# EAGLE design mm_robot_pcb_v6 (EAGLE 9.6.2)
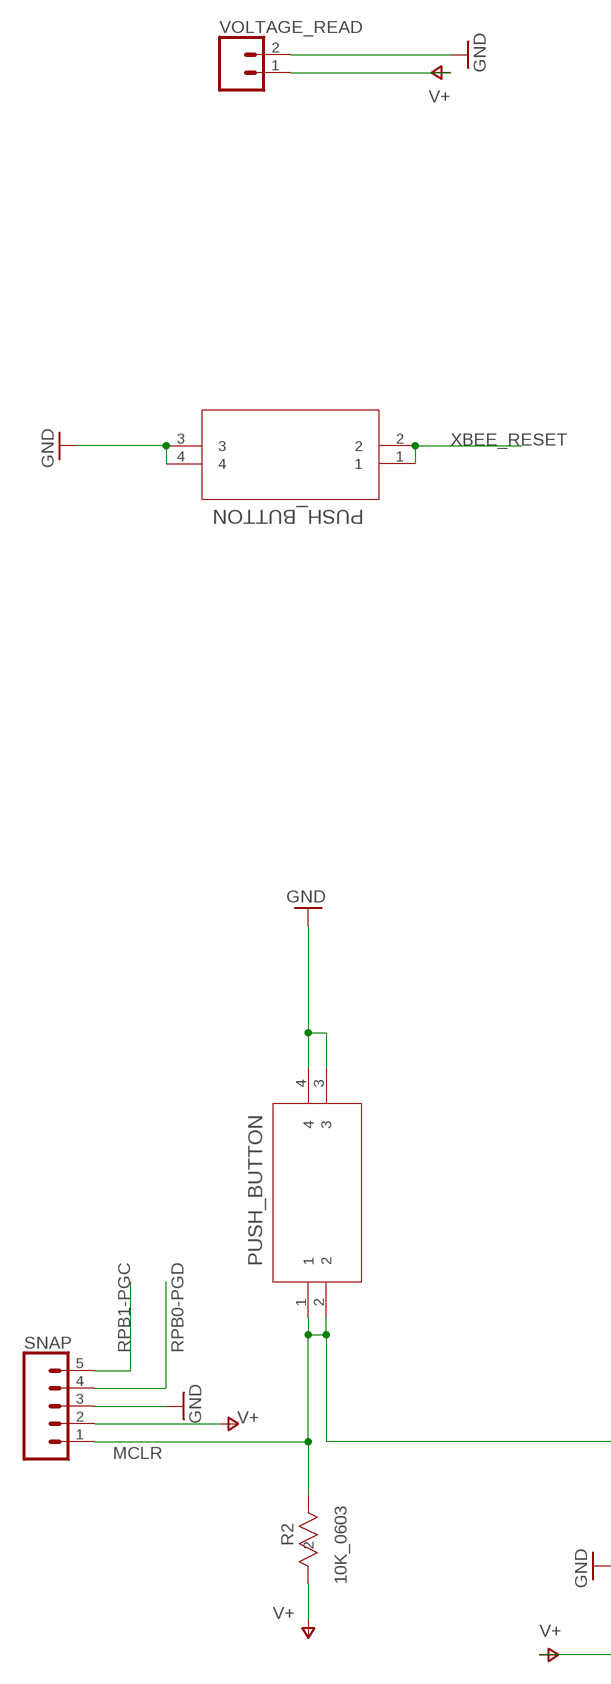
[diagram p0: schematic, sheet 1, part 1 of 2]
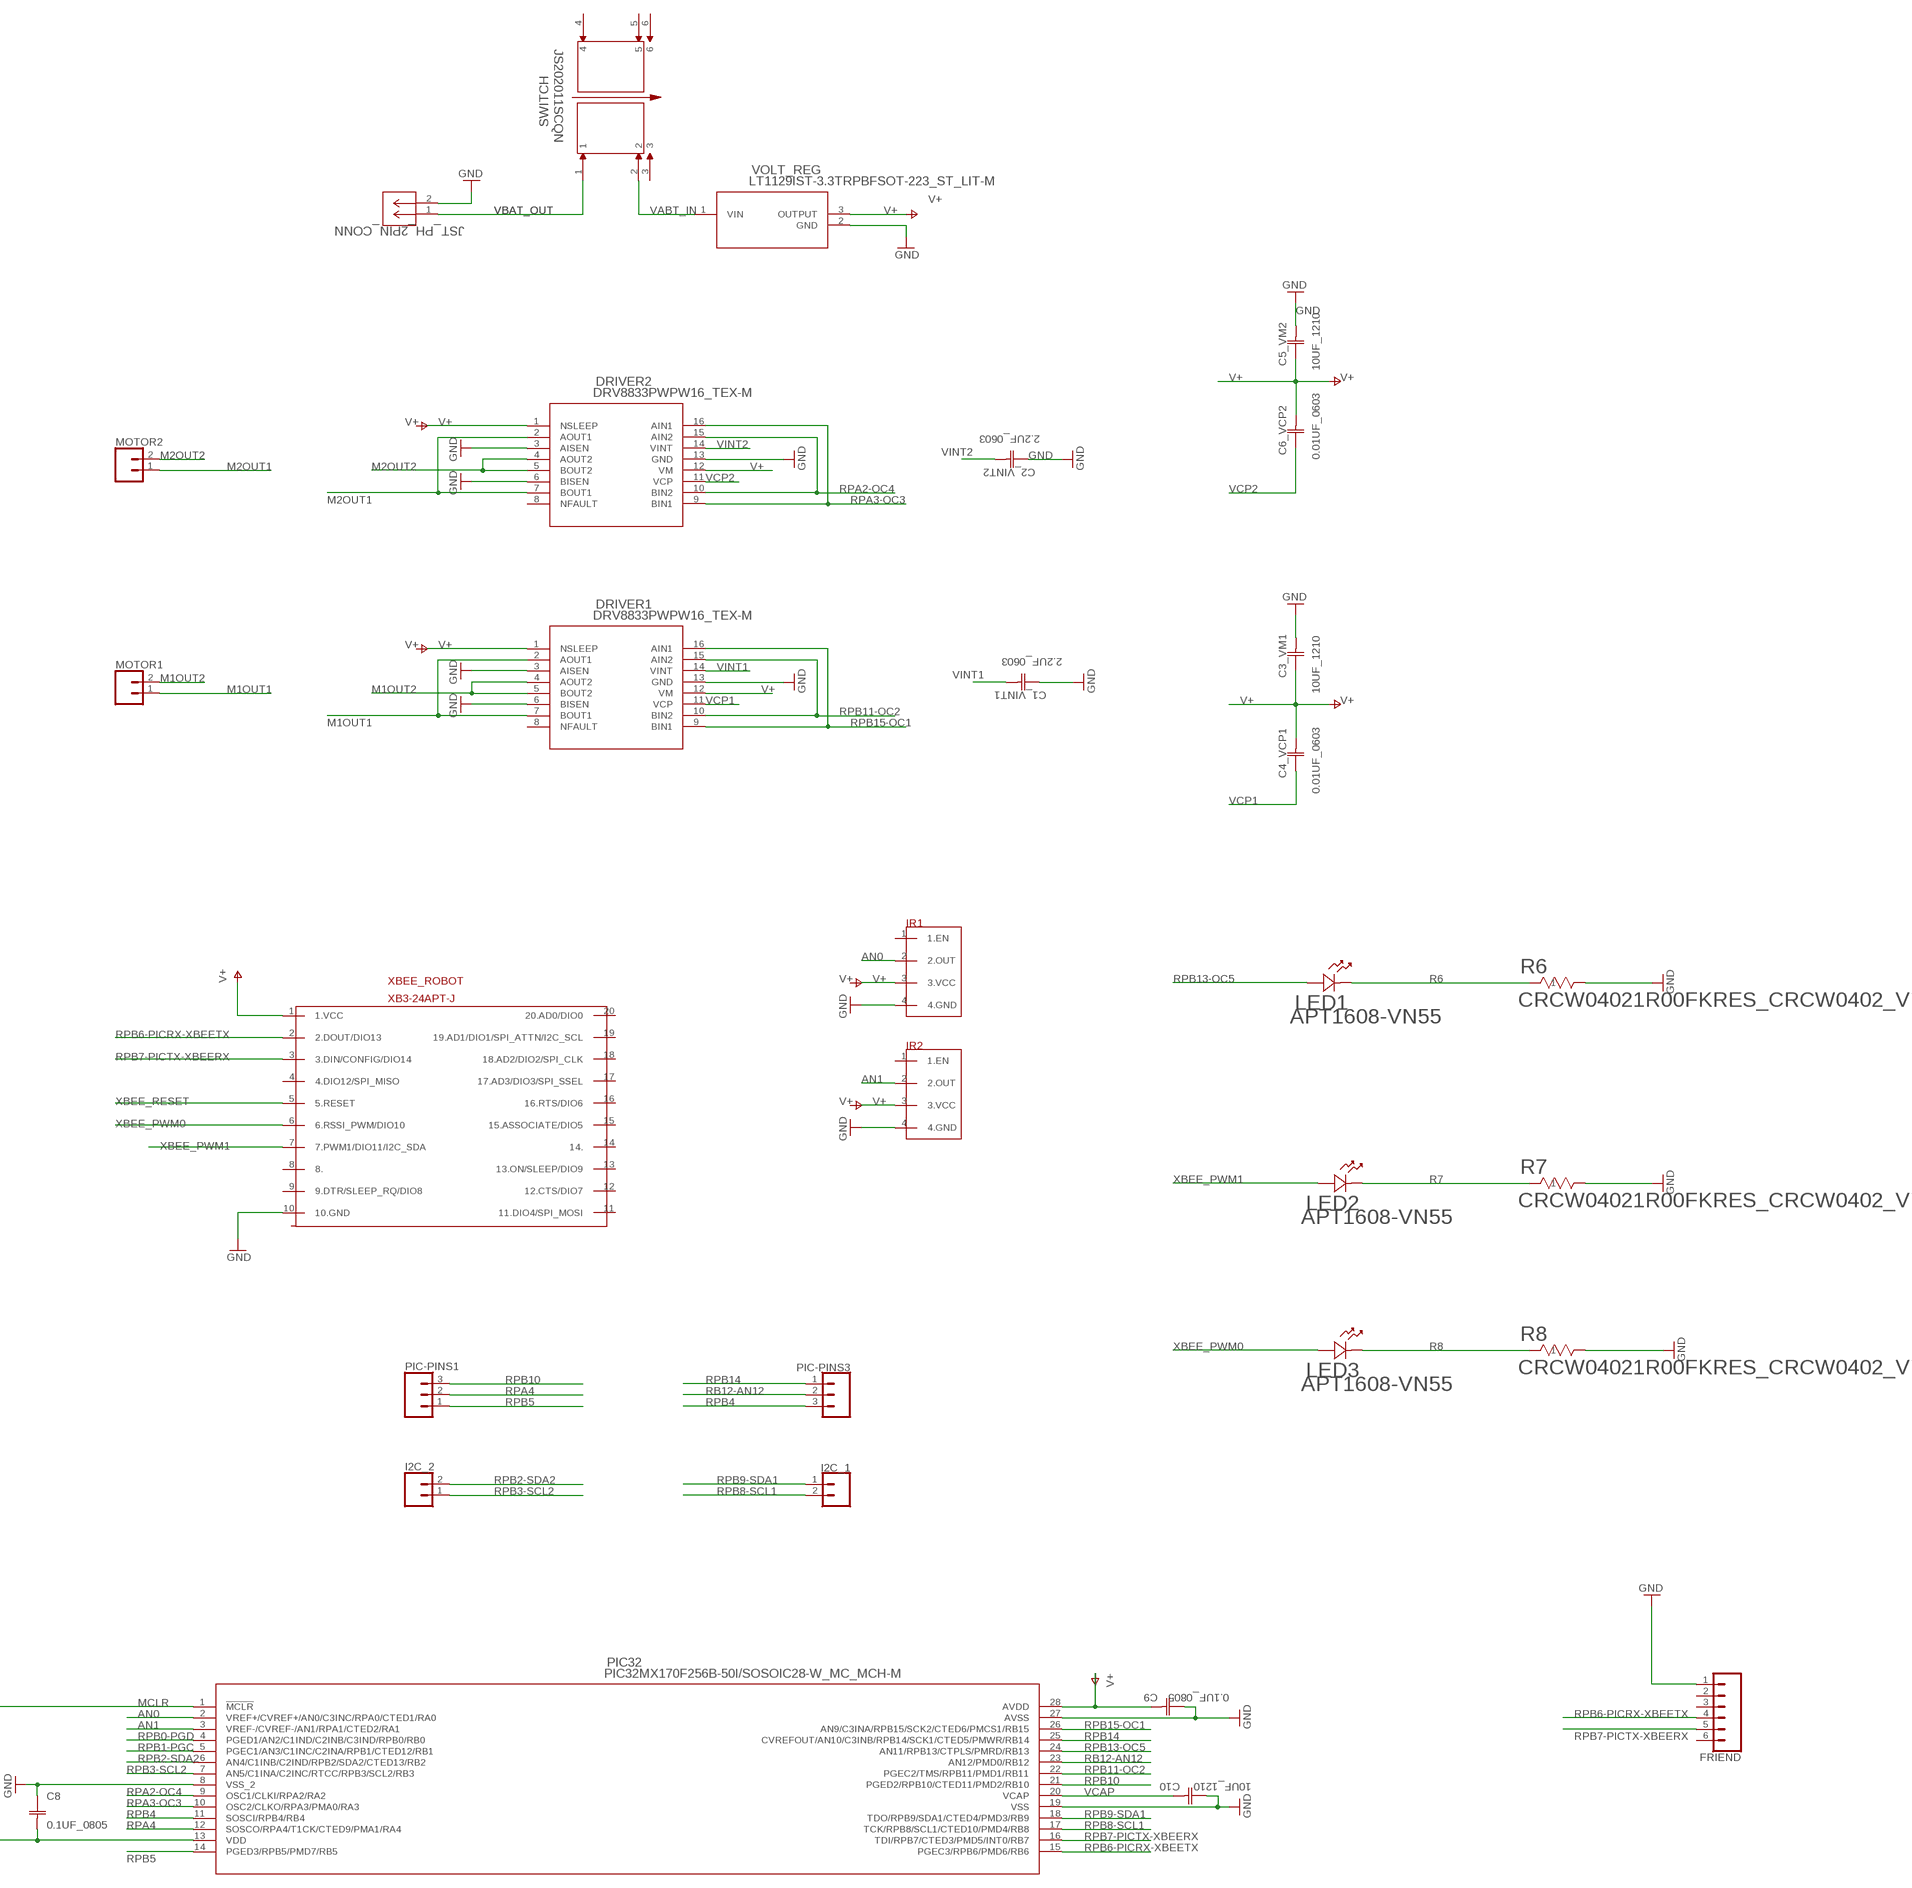
[diagram p1: schematic, sheet 1, part 2 of 2]

## Parts
C1_VINT1  2.2UF_0603  CL10A225KP8NNNCCAP_CL10_SAM-M  [CAP_CL10_SAM-M]
C2_VINT2  2.2UF_0603  CL10A225KP8NNNCCAP_CL10_SAM-M  [CAP_CL10_SAM-M]
C3_VM1  10UF_1210  TPSB106K016R0500CAP_TPS_B_AVX-M  [CAP_TPS_B_AVX-M]
C4_VCP1  0.01UF_0603  01UF_CAP  [CAP_01UF_0603_X7R_G_AVX]
C5_VM2  10UF_1210  TPSB106K016R0500CAP_TPS_B_AVX-M  [CAP_TPS_B_AVX-M]
C6_VCP2  0.01UF_0603  01UF_CAP  [CAP_01UF_0603_X7R_G_AVX]
C8  0.1UF_0805  C2012X7R2A104K125AACAP_C2012X7R2A104K125AA_TDK-M  [CAP_C2012X7R2A104K125AA_TDK-M]
C9  0.1UF_0805  C2012X7R2A104K125AACAP_C2012X7R2A104K125AA_TDK-M  [CAP_C2012X7R2A104K125AA_TDK-M]
C10  10UF_1210  TPSB106K016R0500CAP_TPS_B_AVX-M  [CAP_TPS_B_AVX-M]
DRIVER1  DRV8833PWPW16_TEX-M  [PW16_TEX-M]
DRIVER2  DRV8833PWPW16_TEX-M  [PW16_TEX-M]
FRIEND  CONN_06NO_SILK_FEMALE_PTH  [1X06_NO_SILK]
I2C_1  CONN_02  [1X02]
I2C_2  CONN_02  [1X02]
IR1  GP2Y0A60SZLF  [1X04]
IR2  GP2Y0A60SZLF  [1X04]
JST_PH_2PIN_CONN  1769  [CONN_1769_ADA]
LED1  APT1608-VN55  [LED_APT1608_KNB]
LED2  APT1608-VN55  [LED_APT1608_KNB]
LED3  APT1608-VN55  [LED_APT1608_KNB]
MOTOR1  CONN_02  [1X02]
MOTOR2  CONN_02  [1X02]
PIC32  PIC32MX170F256B-50I/SOSOIC28-W_MC_MCH-M  [SOIC28-W_MC_MCH-M]
PIC-PINS1  455-1750-1-ND  CONN_03  [1X03]
PIC-PINS3  455-1750-1-ND  CONN_03  [1X03]
PIC_PB  PUSH_BUTTON  PTS526_SK15_SMTR2_LFSSMT_FS-M  [SMT_FS-M]
R2  10K_0603  CRG0603F10KRES0603_CRG_TYCO_TYC-M  [RES0603_CRG_TYCO_TYC-M]
R6  CRCW04021R00FKRES_CRCW0402_VIS-M  [RES_CRCW0402_VIS-M]
R7  CRCW04021R00FKRES_CRCW0402_VIS-M  [RES_CRCW0402_VIS-M]
R8  CRCW04021R00FKRES_CRCW0402_VIS-M  [RES_CRCW0402_VIS-M]
SNAP  CONN_05  [1X05]
SWITCH  JS202011SCQN  [SW_JS202011SCQN]
VOLT_REG  LT1129IST-3.3TRPBFSOT-223_ST_LIT-M  [SOT-223_ST_LIT-M]
VOLTAGE_READ  CONN_02  [1X02]
XBEE_PB  PUSH_BUTTON  PTS526_SK15_SMTR2_LFSSMT_FS-M  [SMT_FS-M]
XBEE_ROBOT  XB3-24APT-J  [XB3-24APT-J]

## Nets
AN0: IR1.2(2.OUT) PIC32.2(VREF+/CVREF+/AN0/C3INC/RPA0/CTED1/RA0)
AN1: IR2.2(2.OUT) PIC32.3(VREF-/CVREF-/AN1/RPA1/CTED2/RA1)
GND: C1_VINT1.1 C2_VINT2.1 C3_VM1.2 C5_VM2.2 C8.1 C9.1 C10.1 DRIVER1.3(AISEN) DRIVER1.6(BISEN) DRIVER1.13(GND) DRIVER2.3(AISEN) DRIVER2.6(BISEN) DRIVER2.13(GND) FRIEND.1 IR1.4(4.GND) IR2.4(4.GND) JST_PH_2PIN_CONN.2 PIC32.8(VSS_2) PIC32.19(VSS) PIC32.27(AVSS) PIC_PB.3 PIC_PB.4 R6.2 R7.2 R8.2 SNAP.3 VOLT_REG.2(GND) VOLTAGE_READ.2 XBEE_PB.3 XBEE_PB.4 XBEE_ROBOT.10(10.GND)
M1OUT1: DRIVER1.2(AOUT1) DRIVER1.7(BOUT1) MOTOR1.1
M1OUT2: DRIVER1.4(AOUT2) DRIVER1.5(BOUT2) MOTOR1.2
M2OUT1: DRIVER2.2(AOUT1) DRIVER2.7(BOUT1) MOTOR2.1
M2OUT2: DRIVER2.4(AOUT2) DRIVER2.5(BOUT2) MOTOR2.2
MCLR: PIC32.1(!MCLR) PIC_PB.1 PIC_PB.2 R2.1 SNAP.1
R6: LED1.1 R6.1
R7: LED2.1 R7.1
R8: LED3.1 R8.1
RB12-AN12: PIC32.23(AN12/PMD0/RB12) PIC-PINS3.2
RPA2-OC4: DRIVER2.10(BIN2) DRIVER2.15(AIN2) PIC32.9(OSC1/CLKI/RPA2/RA2)
RPA3-OC3: DRIVER2.9(BIN1) DRIVER2.16(AIN1) PIC32.10(OSC2/CLKO/RPA3/PMA0/RA3)
RPA4: PIC32.12(SOSCO/RPA4/T1CK/CTED9/PMA1/RA4) PIC-PINS1.2
RPB0-PGD: PIC32.4(PGED1/AN2/C1IND/C2INB/C3IND/RPB0/RB0) SNAP.4
RPB1-PGC: PIC32.5(PGEC1/AN3/C1INC/C2INA/RPB1/CTED12/RB1) SNAP.5
RPB2-SDA2: I2C_2.2 PIC32.6(AN4/C1INB/C2IND/RPB2/SDA2/CTED13/RB2)
RPB3-SCL2: I2C_2.1 PIC32.7(AN5/C1INA/C2INC/RTCC/RPB3/SCL2/RB3)
RPB4: PIC32.11(SOSCI/RPB4/RB4) PIC-PINS3.3
RPB5: PIC32.14(PGED3/RPB5/PMD7/RB5) PIC-PINS1.1
RPB6-PICRX-XBEETX: FRIEND.4 PIC32.15(PGEC3/RPB6/PMD6/RB6) XBEE_ROBOT.2(2.DOUT/DIO13)
RPB7-PICTX-XBEERX: FRIEND.5 PIC32.16(TDI/RPB7/CTED3/PMD5/INT0/RB7) XBEE_ROBOT.3(3.DIN/CONFIG/DIO14)
RPB8-SCL1: I2C_1.2 PIC32.17(TCK/RPB8/SCL1/CTED10/PMD4/RB8)
RPB9-SDA1: I2C_1.1 PIC32.18(TDO/RPB9/SDA1/CTED4/PMD3/RB9)
RPB10: PIC32.21(PGED2/RPB10/CTED11/PMD2/RB10) PIC-PINS1.3
RPB11-OC2: DRIVER1.10(BIN2) DRIVER1.15(AIN2) PIC32.22(PGEC2/TMS/RPB11/PMD1/RB11)
RPB13-OC5: LED1.2 PIC32.24(AN11/RPB13/CTPLS/PMRD/RB13)
RPB14: PIC32.25(CVREFOUT/AN10/C3INB/RPB14/SCK1/CTED5/PMWR/RB14) PIC-PINS3.1
RPB15-OC1: DRIVER1.9(BIN1) DRIVER1.16(AIN1) PIC32.26(AN9/C3INA/RPB15/SCK2/CTED6/PMCS1/RB15)
V+: C3_VM1.1 C4_VCP1.2 C5_VM2.1 C6_VCP2.2 C8.2 C9.2 DRIVER1.1(NSLEEP) DRIVER1.12(VM) DRIVER2.1(NSLEEP) DRIVER2.12(VM) IR1.3(3.VCC) IR2.3(3.VCC) PIC32.13(VDD) PIC32.28(AVDD) R2.2 SNAP.2 VOLT_REG.3(OUTPUT) VOLTAGE_READ.1 XBEE_ROBOT.1(1.VCC)
VABT_IN: SWITCH.2 VOLT_REG.1(VIN)
VBAT_OUT: JST_PH_2PIN_CONN.1 SWITCH.1
VCAP: C10.2 PIC32.20(VCAP)
VCP1: C4_VCP1.1 DRIVER1.11(VCP)
VCP2: C6_VCP2.1 DRIVER2.11(VCP)
VINT1: C1_VINT1.2 DRIVER1.14(VINT)
VINT2: C2_VINT2.2 DRIVER2.14(VINT)
XBEE_PWM0: LED3.2 XBEE_ROBOT.6(6.RSSI_PWM/DIO10)
XBEE_PWM1: LED2.2 XBEE_ROBOT.7(7.PWM1/DIO11/I2C_SDA)
XBEE_RESET: XBEE_PB.1 XBEE_PB.2 XBEE_ROBOT.5(5.RESET)
Unconnected: DRIVER1.8(NFAULT) DRIVER2.8(NFAULT) FRIEND.2 FRIEND.3 FRIEND.6 IR1.1(1.EN) IR2.1(1.EN) SWITCH.3 SWITCH.4 SWITCH.5 SWITCH.6 XBEE_ROBOT.4(4.DIO12/SPI_MISO) XBEE_ROBOT.8(8.) XBEE_ROBOT.9(9.DTR/SLEEP_RQ/DIO8) XBEE_ROBOT.11(11.DIO4/SPI_MOSI) XBEE_ROBOT.12(12.CTS/DIO7) XBEE_ROBOT.13(13.ON/SLEEP/DIO9) XBEE_ROBOT.14(14.) XBEE_ROBOT.15(15.ASSOCIATE/DIO5) XBEE_ROBOT.16(16.RTS/DIO6) XBEE_ROBOT.17(17.AD3/DIO3/SPI_SSEL) XBEE_ROBOT.18(18.AD2/DIO2/SPI_CLK) XBEE_ROBOT.19(19.AD1/DIO1/SPI_ATTN/I2C_SCL) XBEE_ROBOT.20(20.AD0/DIO0)

## Library data of the parts
C1_VINT1 C2_VINT2 = micromouse:CL10A225KP8NNNC; COPYRIGHT: Copyright (C) 2021 Ultra Librarian. All rights reserved.; MANUFACTURER_PART_NUMBER: CL10A225KP8NNNC; MFR_NAME: Samsung
C3_VM1 C5_VM2 C10 = micromouse:TPSB106K016R0500; COPYRIGHT: Copyright (C) 2021 Ultra Librarian. All rights reserved.; MANUFACTURER_PART_NUMBER: TPSB106K016R0500; MFR_NAME: AVX Corporation
C4_VCP1 C6_VCP2 = micromouse:01UF_CAP
C8 C9 = micromouse:C2012X7R2A104K125AA; COPYRIGHT: Copyright (C) 2021 Ultra Librarian. All rights reserved.; MANUFACTURER_PART_NUMBER: C2012X7R2A104K125AA; MFR_NAME: TDK
DRIVER1 DRIVER2 = DRV8833PW:DRV8833PW; COPYRIGHT: Copyright (C) 2021 Ultra Librarian. All rights reserved.; MANUFACTURER_PART_NUMBER: DRV8833PW; MFR_NAME: Texas Instruments
FRIEND = micromouse:CONN_06: Multi connection point. Often used as Generic Header-pin footprint for 0.1 inch spaced/style header connections On any of the 0.1 inch spaced packages, you can populate with these: Break Away Headers - Straight <https://www.sparkfun.com/products/116> (PRT-00116) Break Away Male Headers - Right Angle <https://www.sparkfun.com/products/553> (PRT-00553) Female Headers <https://www.sparkfun.com/products/115> (PRT-00115) Break Away Headers - Machine Pin <https://www.sparkfun.com/products/117> (PRT-00117) Break Away Female Headers - Swiss Machine Pin <https://www.sparkfun.com/products/743> (PRT-00743) Arduino Stackable Header - 6 Pin <https://www.sparkfun.com/products/9280> (PRT-09280) For SCREWTERMINALS and SPRING TERMINALS visit here: Screw Terimnals on SparkFun.com <https://www.sparkfun.com/search/results?term=Screw+Terminals> (5mm/3.5mm/2.54mm spacing) This device is also useful as a general connection point to wire up your design to another part of your project. Our various solder wires solder well into these plated through hole pads. Hook-Up Wire - Assortment (Stranded, 22 AWG) <https://www.sparkfun.com/products/11375> (PRT-11375) Hook-Up Wire - Assortment (Solid Core, 22 AWG) <https://www.sparkfun.com/products/11367> (PRT-11367) View the entire wire category on our website here <https://www.sparkfun.com/categories/141>; PROD_ID: CONN-08437
I2C_1 I2C_2 MOTOR1 MOTOR2 VOLTAGE_READ = micromouse:CONN_02: Multi connection point. Often used as Generic Header-pin footprint for 0.1 inch spaced/style header connections On any of the 0.1 inch spaced packages, you can populate with these: Break Away Headers - Straight <https://www.sparkfun.com/products/116> (PRT-00116) Break Away Male Headers - Right Angle <https://www.sparkfun.com/products/553> (PRT-00553) Female Headers <https://www.sparkfun.com/products/115> (PRT-00115) Break Away Headers - Machine Pin <https://www.sparkfun.com/products/117> (PRT-00117) Break Away Female Headers - Swiss Machine Pin <https://www.sparkfun.com/products/743> (PRT-00743) For SCREWTERMINALS and SPRING TERMINALS visit here: Screw Terimnals on SparkFun.com <https://www.sparkfun.com/search/results?term=Screw+Terminals> (5mm/3.5mm/2.54mm spacing) This device is also useful as a general connection point to wire up your design to another part of your project. Our various solder wires solder well into these plated through hole pads. Hook-Up Wire - Assortment (Stranded, 22 AWG) <https://www.sparkfun.com/products/11375> (PRT-11375) Hook-Up Wire - Assortment (Solid Core, 22 AWG) <https://www.sparkfun.com/products/11367> (PRT-11367) View the entire wire category on our website here <https://www.sparkfun.com/categories/141> Special notes: Molex polarized connector foot print use with: PRT-08233 with associated crimp pins and housings. 2.54_SCREWTERM for use with PRT-10571. 3.5mm Screw Terminal footprints for PRT-08084 5mm Screw Terminal footprints for use with PRT-08432
IR1 IR2 = micromouse:GP2Y0A60SZLF
JST_PH_2PIN_CONN = micromouse:1769; COPYRIGHT: Copyright (C) 2021 Ultra Librarian. All rights reserved.; MANUFACTURER_PART_NUMBER: 1769; MFR_NAME: Adafruit Industries
LED1-LED3 = micromouse:APT1608-VN55; COPYRIGHT: Copyright (C) 2021 Ultra Librarian. All rights reserved.; MANUFACTURER_PART_NUMBER: APT1608-VN55; MFR_NAME: Kingbright
PIC32 = micromouse:PIC32MX170F256B-50I/SO; COPYRIGHT: Copyright (C) 2021 Ultra Librarian. All rights reserved.; MANUFACTURER_PART_NUMBER: PIC32MX170F256B-50I/SO; MFR_NAME: Microchip
PIC-PINS1 PIC-PINS3 = micromouse:CONN_03: Multi connection point. Often used as Generic Header-pin footprint for 0.1 inch spaced/style header connections On any of the 0.1 inch spaced packages, you can populate with these: Break Away Headers - Straight <https://www.sparkfun.com/products/116> (PRT-00116) Break Away Male Headers - Right Angle <https://www.sparkfun.com/products/553> (PRT-00553) Female Headers <https://www.sparkfun.com/products/115> (PRT-00115) Break Away Headers - Machine Pin <https://www.sparkfun.com/products/117> (PRT-00117) Break Away Female Headers - Swiss Machine Pin <https://www.sparkfun.com/products/743> (PRT-00743) Stackable Header - 3 Pin (Female, 0.1") <https://www.sparkfun.com/products/13875> (PRT-13875) For SCREWTERMINALS and SPRING TERMINALS visit here: Screw Terimnals on SparkFun.com <https://www.sparkfun.com/search/results?term=Screw+Terminals> (5mm/3.5mm/2.54mm spacing) This device is also useful as a general connection point to wire up your design to another part of your project. Our various solder wires solder well into these plated through hole pads. Hook-Up Wire - Assortment (Stranded, 22 AWG) <https://www.sparkfun.com/products/11375> (PRT-11375) Hook-Up Wire - Assortment (Solid Core, 22 AWG) <https://www.sparkfun.com/products/11367> (PRT-11367) View the entire wire category on our website here <https://www.sparkfun.com/categories/141> Special notes: Molex polarized connector foot print use with SKU : PRT-08232 with associated crimp pins and housings.; PROD_ID: XXX-00000
PIC_PB XBEE_PB = micromouse:PTS526_SK15_SMTR2_LFS; COPYRIGHT: Copyright (C) 2021 Ultra Librarian. All rights reserved.; MANUFACTURER_PART_NUMBER: PTS526 SK15 SMTR2 LFS; MFR_NAME: C&K
R2 = micromouse:CRG0603F10K; COPYRIGHT: Copyright (C) 2021 Ultra Librarian. All rights reserved.; MANUFACTURER_PART_NUMBER: CRG0603F10K; MFR_NAME: TE Connectivity
R6-R8 = micromouse:CRCW04021R00FK; COPYRIGHT: Copyright (C) 2021 Ultra Librarian. All rights reserved.; MANUFACTURER_PART_NUMBER: CRCW04021R00FK; MFR_NAME: Vishay
SNAP = micromouse:CONN_05: Multi connection point. Often used as Generic Header-pin footprint for 0.1 inch spaced/style header connections On any of the 0.1 inch spaced packages, you can populate with these: Break Away Headers - Straight <https://www.sparkfun.com/products/116> (PRT-00116) Break Away Male Headers - Right Angle <https://www.sparkfun.com/products/553> (PRT-00553) Female Headers <https://www.sparkfun.com/products/115> (PRT-00115) Break Away Headers - Machine Pin <https://www.sparkfun.com/products/117> (PRT-00117) Break Away Female Headers - Swiss Machine Pin <https://www.sparkfun.com/products/743> (PRT-00743) For SCREWTERMINALS and SPRING TERMINALS visit here: Screw Terimnals on SparkFun.com <https://www.sparkfun.com/search/results?term=Screw+Terminals> (5mm/3.5mm/2.54mm spacing) This device is also useful as a general connection point to wire up your design to another part of your project. Our various solder wires solder well into these plated through hole pads. Hook-Up Wire - Assortment (Stranded, 22 AWG) <https://www.sparkfun.com/products/11375> (PRT-11375) Hook-Up Wire - Assortment (Solid Core, 22 AWG) <https://www.sparkfun.com/products/11367> (PRT-11367) View the entire wire category on our website here <https://www.sparkfun.com/categories/141> Special notes: Molex polarized connector foot print use with SKU : PRT-08231 with associated crimp pins and housings. 1MM SMD Version SKU: PRT-10208
SWITCH = micromouse:JS202011SCQN; COPYRIGHT: Copyright (C) 2021 Ultra Librarian. All rights reserved.; MANUFACTURER_PART_NUMBER: JS202011SCQN; MFR_NAME: C&K
VOLT_REG = LT1129IST-3.3#TRPBF:LT1129IST-3.3TRPBF; COPYRIGHT: Copyright (C) 2021 Ultra Librarian. All rights reserved.; MANUFACTURER_PART_NUMBER: LT1129IST-3.3#TRPBF; MFR_NAME: Analog Devices / Linear Technology
XBEE_ROBOT = micromouse:XB3-24APT-J

## Board
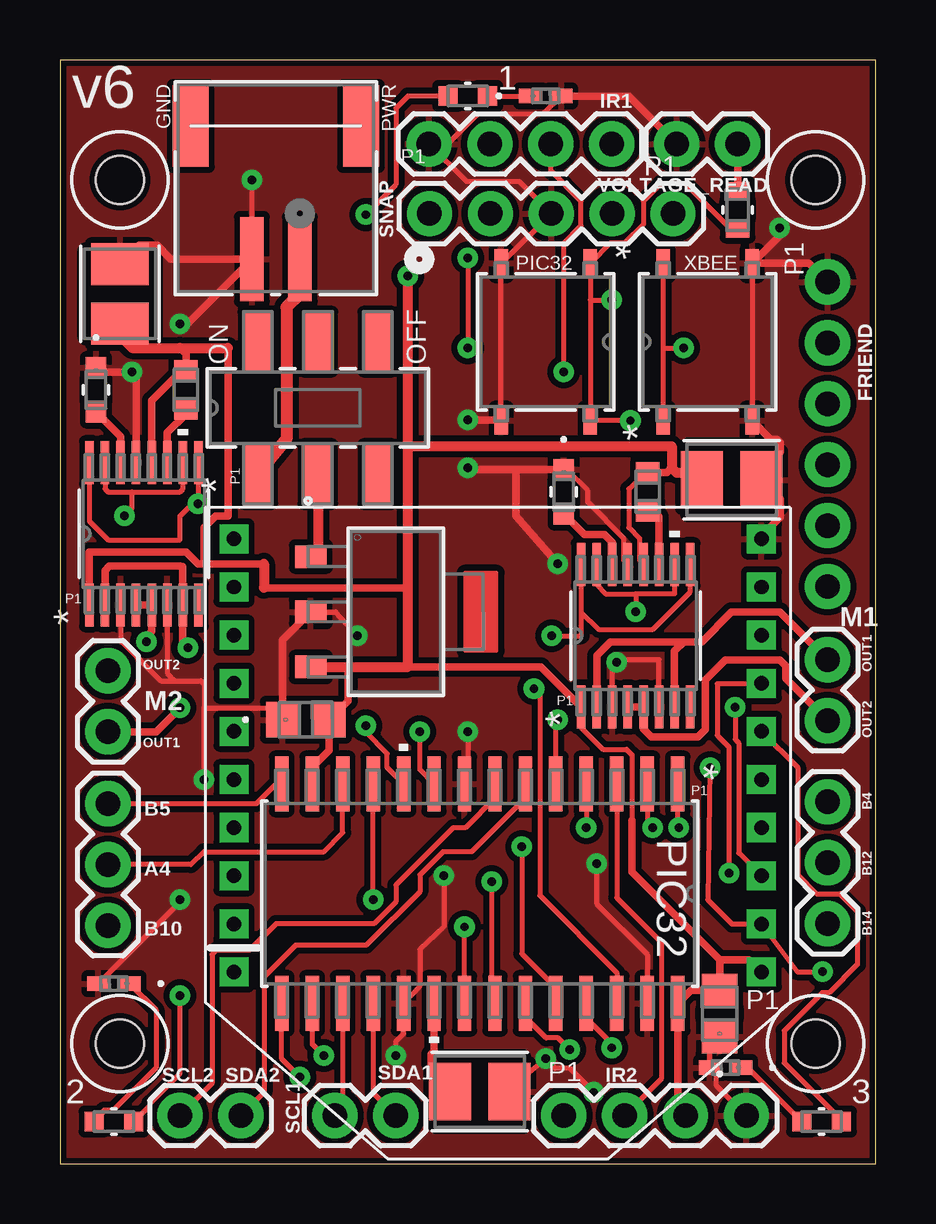
[diagram p2: board, top side]
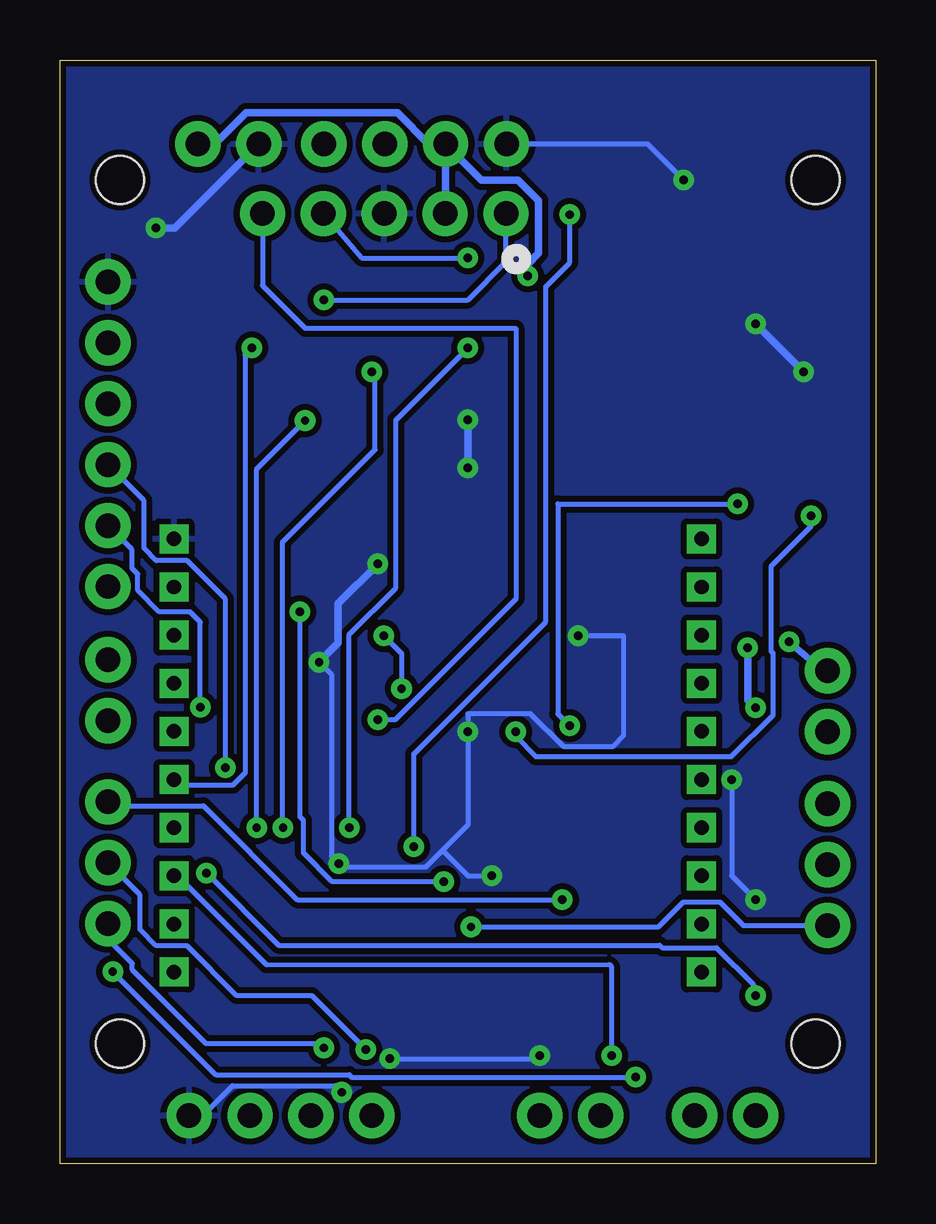
[diagram p3: board, bottom side, seen from below]

Size 34 x 46 mm. Coordinates in mm from the lower left corner, seen from the top.
Outline: 0,0 34,0 34,46 0,46 0,0
Copper layers (1*16): Top 0.035mm / dielectric 1.5mm / Bottom 0.035mm
Design rules "SparkFun": minimum track width 8mil, minimum drill 20mil, track to track 8mil, track to pad 8mil, pad to pad 8mil, via to via 8mil, smd to smd 8mil, copper to edge 8mil, drill to drill 8mil, minimum pad ring 12mil, minimum via ring 10mil, stop-mask expansion 4mil, vias tented up to drill 20mil, thermal gap 10mil
Holes 2 mm at 2.5,5 31.5,5 31.5,41 2.5,41

### Footprints (pad centres in the part's own frame; a part is rotated, then mirrored left to right if it is on the bottom)
CAP_CL10_SAM-M = smd 0.859 x 0.851: 1 -0.929,0; 2 0.929,0
CAP_TPS_B_AVX-M = smd 1.738 x 2.413: 1 -1.239,0; 2 1.239,0
CAP_01UF_0603_X7R_G_AVX = smd 0.864 x 0.965: 1 -0.8,0; 2 0.8,0
CAP_C2012X7R2A104K125AA_TDK-M = smd 1.397 x 1.499: 1 -0.965,0; 2 0.965,0
PW16_TEX-M = smd 1.778 x 0.356: 1 -2.972,2.275; 2 -2.972,1.625; 3 -2.972,0.975; 4 -2.972,0.325; 5 -2.972,-0.325; 6 -2.972,-0.975; 7 -2.972,-1.625; 8 -2.972,-2.275; 9 2.972,-2.275; 10 2.972,-1.625; 11 2.972,-0.975; 12 2.972,-0.325; 13 2.972,0.325; 14 2.972,0.975; 15 2.972,1.625; 16 2.972,2.275
1X06_NO_SILK = drill 1.016 pad 1.88: 1 0,0; 2 2.54,0; 3 5.08,0; 4 7.62,0; 5 10.16,0; 6 12.7,0
1X02 = drill 1.016 pad 1.88: 1 0,0; 2 2.54,0
1X04 = drill 1.016 pad 1.88: 1 0,0; 2 2.54,0; 3 5.08,0; 4 7.62,0
CONN_1769_ADA = smd 0.991 x 3.505: 1 0,0; 2 2,0 | smd 1.499 x 3.404: 3 -2.55,-5.55; 4 4.55,-5.55
LED_APT1608_KNB = smd 0.8 x 0.813: 1 -0.819,0; 2 0.819,0
SOIC28-W_MC_MCH-M = smd 2.286 x 0.559: 1 -4.572,8.255; 2 -4.572,6.985; 3 -4.572,5.715; 4 -4.572,4.445; 5 -4.572,3.175; 6 -4.572,1.905; 7 -4.572,0.635; 8 -4.572,-0.635; 9 -4.572,-1.905; 10 -4.572,-3.175; 11 -4.572,-4.445; 12 -4.572,-5.715; 13 -4.572,-6.985; 14 -4.572,-8.255; 15 4.572,-8.255; 16 4.572,-6.985; 17 4.572,-5.715; 18 4.572,-4.445; 19 4.572,-3.175; 20 4.572,-1.905; 21 4.572,-0.635; 22 4.572,0.635; 23 4.572,1.905; 24 4.572,3.175; 25 4.572,4.445; 26 4.572,5.715; 27 4.572,6.985; 28 4.572,8.255
1X03 = drill 1.016 pad 1.88: 1 0,0; 2 2.54,0; 3 5.08,0
SMT_FS-M = smd 1.156 x 0.559: 1 -3.283,1.854; 2 3.283,1.854; 3 -3.283,-1.854; 4 3.283,-1.854
RES0603_CRG_TYCO_TYC-M = smd 0.711 x 0.991: 1 -0.8,0; 2 0.8,0
RES_CRCW0402_VIS-M = smd 0.914 x 0.61: 1 -0.648,0; 2 0.648,0
1X05 = drill 1.016 pad 1.88: 1 0,0; 2 2.54,0; 3 5.08,0; 4 7.62,0; 5 10.16,0
SW_JS202011SCQN = smd 2.489 x 1.194: 1 -2.756,2.5; 2 -2.756,0; 3 -2.756,-2.5; 4 2.756,-2.5; 5 2.756,0; 6 2.756,2.5
SOT-223_ST_LIT-M = smd 0.94 x 1.321: 1 -2.299,-3.543; 2 0,-3.543; 3 2.299,-3.543
XB3-24APT-J = drill 0.6 square: 1 -10.998,6.02; 2 -10.998,4.013; 3 -10.998,2.007; 4 -10.998,0; 5 -10.998,-2.007; 6 -10.998,-4.013; 7 -10.998,-6.02; 8 -10.998,-8.026; 9 -10.998,-10.033; 10 -10.998,-12.04; 11 10.998,-12.04; 12 10.998,-10.033; 13 10.998,-8.026; 14 10.998,-6.02; 15 10.998,-4.013; 16 10.998,-2.007; 17 10.998,0; 18 10.998,2.007; 19 10.998,4.013; 20 10.998,6.02

### Placement (x,y rotation side)
C1_VINT1  21,28 270 top
C2_VINT2  1.5,32.25 270 top
C3_VM1  28,28.5 0 top
C4_VCP1  24.5,28 90 top
C5_VM2  2.5,36.25 90 top
C6_VCP2  5.25,32.25 90 top
C8  10.25,18.5 0 top
C9  27.5,6.25 90 top
C10  17.5,3 180 top
DRIVER1  24,22 90 top
DRIVER2  3.5,26.25 90 top
FRIEND  32,36.75 270 top
I2C_1  14,2 180 top
I2C_2  5,2 0 top
IR1  23,42.5 180 top
IR2  21,2 0 top
JST_PH_2PIN_CONN  10,37.7 180 top
LED1  17,44.5 180 top
LED2  2.25,1.75 0 top
LED3  31.75,1.75 0 top
MOTOR1  32,21 270 top
MOTOR2  2,18 90 top
PIC32  17.5,11.25 270 top
PIC-PINS1  2,15 270 top
PIC-PINS3  32,10 90 top
PIC_PB  20.25,34.25 270 top
R2  28.25,39.75 90 top
R6  20.25,44.5 0 top
R7  2.25,7.5 180 top
R8  27.75,4 180 top
SNAP  15.4,39.6 0 top
SWITCH  10.75,31.5 90 top
VOLT_REG  14,23 270 top
VOLTAGE_READ  28.25,42.5 180 top
XBEE_PB  27,34.25 90 top
XBEE_ROBOT  18.25,14 180 top

### Tracks (layer width: path | path; a pad name or v marks a point on that pad's centre or on a via)
AN0  (via drill 0.35)
  Top 0.203: PIC32.2 24.48,14 v24.7,14 | IR1.2 20.46,41.38 21.73,40.12 21.73,39.08 21,38.36 v21,33
  Bottom 0.203: v24.7,14 24.73,14.03 24.73,25.88 20.86,29.75 20.86,33 v21,33
AN1
  Top 0.203: PIC32.3 23.21,11.08 25.07,9.23 25.07,3.53 IR2.2
GND  (via drill 0.35)
  Top 0.203: XBEE_PB.4 XBEE_PB.3 | IR1.4 16.94,40.94 19.14,40.94 SNAP.3 18.41,37.53 PIC_PB.3 PIC_PB.4 | 16.16,42.5 17.4,43.74 20.14,43.74 R6.2 | DRIVER1.3 23.02,20.98 | 23.02,20.98 23,21 | DRIVER1.6 24.98,21 23.05,21 23.02,20.98 | IR2.4 27.35,3.27 27.35,3.75 R8.2 27.1,4.89 C9.1 | v16,12 16,9.87 15,8.93 15,7.42 PIC32.19 14.32,5.41 14,5.09 v14,4.5 | 4.8,20.12 4.6,20.31 4.47,20.43 DRIVER2.6 | v6,16 6,19 | v5,11 5,10.9 R7.2 | C10.1 18.74,3.11 v20.25,4.37 20.65,3.97 21.25,3.97 v22.25,2.97 | JST_PH_2PIN_CONN.2 v8,41 | C8.1 8.79,19 6,19 | v12.4,22 11.49,23 VOLT_REG.2 | DRIVER2.3 2.52,21.8 4.21,20.12 4.8,20.12 | v17,18 17,15.96 PIC32.8 | DRIVER1.13 23.51,25.14 23.51,26.05 22,27.56 22,28.05 21.12,28.93 C1_VINT1.1 | v22.37,12.5 22.37,10.83 24.48,8.71 PIC32.27 | 4.8,20.12 5.88,20.12 6,20 6,19
  Top 0.305: VOLTAGE_READ.2 23.71,44.5 R6.2 | 16.16,42.5 IR1.4 | FRIEND.1 31.22,37.53 XBEE_PB.4 30,38.68 v30,39 | XBEE_PB.3 29.64,30.18 29.9,30.18 30.03,30.04 30.03,29.66 29.24,28.87 C3_VM1.2 30.03,27.71 30.03,26.96 29.25,26.17 XBEE_ROBOT.10 | C1_VINT1.1 19,28.93 | 19,28.93 17.07,28.93 v17,29 | v17,31 18.36,31 PIC_PB.4 | 23,21 v23.2,20.9 | v20.75,25 19,27 19,28.93 | C5_VM2.2 3.29,38.28 4.04,38.28 4.62,37.7 JST_PH_2PIN_CONN.2 5.3,35 v5,35 | C2_VINT2.1 1.68,33 v3,33 3.17,32.83 DRIVER2.13 | VOLT_REG.2 9.29,21.83 C8.1
  Bottom 0.203: 18.05,13.05 18.74,12.37 22.24,12.37 v22.37,12.5 22.68,12.81 22.68,20.38 v23.2,20.9 | 18.05,13.05 17,12 v16,12 | v6,16 6,12 v5,11 | v8,41 9.5,42.5 IR1.4 | v14,4.5 14.13,4.37 v20.25,4.37 | v12.4,22 10.5,22 10.5,17.87 10.97,17.37 13,17.37 14.38,18.75 17,18.75 v17,18 17,14.11 18.05,13.05 | IR2.4 28.06,2 26.81,3.25 22.53,3.25 v22.25,2.97
  Bottom 0.305: v30,39 29.21,39 VOLTAGE_READ.2 | v17,29 v17,31 | v20.75,25 22.41,23.34 22.41,21.69 v23.2,20.9 | v5,35 v3,33
  pour Bottom (isolate 0.254): 0,0 34,0 34,46 0,46
  pour Top (isolate 0.254): 0,0 34,0 34,46 0,46
M1OUT1
  Top 0.305: 26,21.75 26.75,21.75 27.99,22.99 30.01,22.99 MOTOR1.1 | DRIVER1.7 25.62,21.38 26,21.75 | 26,21.75 22.94,21.75 22.38,21.18 DRIVER1.2
M1OUT2
  Top 0.305: DRIVER1.4 DRIVER1.5 24.32,18.11 24.65,17.78 26.6,17.78 26.9,18.08 26.9,20.15 27.73,20.98 30,20.98 30.25,20.73 30.25,20.21 MOTOR1.2
M2OUT1  (via drill 0.35)
  Top 0.305: v5,19 4,18 MOTOR2.1 | DRIVER2.2 1.88,24.72 2.05,24.9 5,24.9 5.12,24.88 DRIVER2.7 5.12,21.7 v5.33,21.5
  Bottom 0.305: v5.33,21.5 5.33,19.32 v5,19
M2OUT2  (via drill 0.35)
  Top 0.305: DRIVER2.4 DRIVER2.5 3.83,22.18 3.65,22 v3.61,21.75
  Bottom 0.305: v3.61,21.75 2.15,20.54 MOTOR2.2
MCLR  (via drill 0.35)
  Top 0.203: 22.1,36 PIC_PB.1 22.93,38.35 23.54,38.35 24.32,39.13 24.32,40.12 25.04,40.84 26.08,40.84 27.97,38.95 R2.1 | 22.1,36 PIC_PB.2 22.14,31 23.75,31 v23.78,30.97 | v25.8,14 25.75,14.01 PIC32.1 | 22.1,36 v23,36
  Bottom 0.203: v25.8,14 25.8,28.95 v23.78,30.97 | v23,36 17,36 15.4,37.6 SNAP.1
R6
  Top 0.203: LED1.1 R6.1
R7
  Top 0.203: R7.1 4,6.4 4,4 2.22,2.22 1.83,2.22 1.77,2.15 1.77,2.09 LED2.1
R8
  Top 0.203: R8.1 28.68,4 LED3.1
RB12-AN12  (via drill 0.35)
  Top 0.203: v21.25,4.75 20.77,5.23 20.27,5.23 19.41,6.09 PIC32.23
  Bottom 0.203: PIC-PINS3.2 30.66,11.2 30.66,9.76 29.98,9.08 28.7,9.08 26.63,7 23.5,7 v21.25,4.75
RPA2-OC4  (via drill 0.35)
  Top 0.203: DRIVER2.15 1.88,28.12 2,28 3,28 | 3,28 5,28 5.12,28.12 DRIVER2.10 | v2.69,27 3,27.31 3,28 | PIC32.9 15,16.42 v15,18
  Bottom 0.203: v2.69,27 2.69,26.56 4.35,24.9 4.35,21.35 4.27,21.27 4.27,18.7 6,16.96 14.17,16.96 15,17.79 v15,18
RPA3-OC3  (via drill 0.35)
  Top 0.203: DRIVER2.9 5.78,27.73 v5.75,27.5 5.5,27.5 5,27 5,26 2,26 1.23,26.77 DRIVER2.16 | PIC32.10 13.64,16.51 13.64,17.09 12.75,17.98 v12.75,18.25
  Bottom 0.203: v12.75,18.25 13.25,18.75 13.25,27.5 v5.75,27.5
RPA4
  Top 0.203: PIC32.12 11.79,13.79 11,13 6,13 5.46,12.46 PIC-PINS1.2
RPB0-PGD  (via drill 0.35)
  Top 0.203: PIC32.4 v21.95,14 | v17,37.75 v17,34
  Bottom 0.203: v17,34 20,31 20,24 21.95,22.05 v21.95,14 | SNAP.4 21.42,37.75 v17,37.75
RPB1-PGC  (via drill 0.35)
  Top 0.203: PIC32.5 20.68,18.43 v20.75,18.5
  Bottom 0.203: v20.75,18.5 20.02,18.5 15,23.52 15,34.81 23.77,34.81 25.56,36.6 SNAP.5
RPB2-SDA2
  Top 0.203: PIC32.6 19.41,15.24 17.17,13 15.96,13 15,12.04 15,11.33 12.77,9.1 9.81,9.1 8.5,7.79 8.5,2.96 I2C_2.2
RPB3-SCL2
  Top 0.203: I2C_2.1 6.34,3.34 6.34,8.71 6.52,8.89 7.89,8.89 9,10 13.09,10 14,10.91 14,11.61 16.39,14 16.9,14 18.14,15.24 PIC32.7
RPB4  (via drill 0.35)
  Top 0.203: v13.05,11 PIC32.11
  Bottom 0.203: PIC-PINS3.3 31.83,14.91 28.02,14.91 24.11,11 v13.05,11
RPB5
  Top 0.203: PIC32.14 9,15.82 8.18,15 PIC-PINS1.1
RPB6-PICRX-XBEETX  (via drill 0.35)
  Top 0.203: v27.1,16.5 27,11 28.01,9.99 XBEE_ROBOT.2 30.73,8 v31.8,8 | v10,3.6 9.24,4.36 PIC32.15
  Bottom 0.203: v10,3.6 21.84,3.6 21.95,3.7 27.5,3.7 v31.8,8 | FRIEND.4 30.5,27.63 30.5,25.65 29.98,25.13 28.7,25.13 27.1,23.52 v27.1,16.5
RPB7-PICTX-XBEERX  (via drill 0.35)
  Top 0.203: PIC32.16 10.52,4.99 v11,4.5 | v28.15,19.02 28.15,17.68 28.3,17.53 28.3,12.94 XBEE_ROBOT.3
  Bottom 0.203: FRIEND.5 31,25.59 31,24.81 30.75,24.57 30.75,23.9 29.86,23 28.58,23 28.15,22.57 v28.15,19.02 | XBEE_ROBOT.3 29.1,11.99 25.39,8.28 11.1,8.3 11.1,8.29 11,8.19 v11,4.5
RPB8-SCL1
  Top 0.203: PIC32.17 11.79,2.33 I2C_1.2
RPB9-SDA1
  Top 0.203: PIC32.18 13.05,2.94 I2C_1.1
RPB10  (via drill 0.35)
  Top 0.203: PIC32.21 v16.86,9.87
  Bottom 0.203: v16.86,9.87 9.05,9.87 8.02,10.9 6.49,10.9 5.51,9.92 PIC-PINS1.3
RPB11-OC2  (via drill 0.35)
  Top 0.203: 24,23.75 25.62,23.75 DRIVER1.10 | 24,23.75 v24,23 | PIC32.22 18,6.81 v18,11.75 | DRIVER1.15 22.38,24.12 22.75,23.75 24,23.75
  Bottom 0.203: v24,23 24,14.45 23.85,14.3 23.85,12.94 22.66,11.75 v18,11.75
RPB13-OC5  (via drill 0.35)
  Top 0.203: v12.75,39.55 14,40.8 14,44 14.5,44.5 LED1.2 | v19.25,13.2 19.25,8.75 20.68,7.33 PIC32.24
  Bottom 0.203: v12.75,39.55 12.75,37.55 13.75,36.55 13.75,22.57 19.25,17.07 v19.25,13.2
RPB14  (via drill 0.35)
  Top 0.203: PIC32.25 22,6.62 22,6 23,5 v23,4.82
  Bottom 0.203: v23,4.82 23.18,5 27.91,5 30.99,8.08 30.99,8.34 32,9.35 PIC-PINS3.1
RPB15-OC1  (via drill 0.35)
  Top 0.203: DRIVER1.16 21.73,23 | 21.73,23 21.73,22 v20.5,22 | DRIVER1.9 26.27,23.82 24.72,22.27 22.46,22.27 21.73,23 | v19.76,19.8 20,19.56 20,11.17 23.21,7.96 PIC32.26
  Bottom 0.203: v20.5,22 19.76,21.26 v19.76,19.8
V+  (via drill 0.35)
  Top 0.203: DRIVER1.12 24.16,25.14 24.16,26.06 23.71,26.5 23.71,28.12 24.39,28.8 C4_VCP1.2 | DRIVER1.1 21.73,18.18 22.64,17.27 23.62,17.27 23.85,17.04 23.85,14.3
  Top 0.305: 14.5,20.7 20.05,20.7 DRIVER1.1 | 26.76,28.8 C3_VM1.1 | 25.5,29 25.3,28.8 C4_VCP1.2 | 5,34 5.25,33.75 C6_VCP2.2 5.2,33 5.02,33 3.83,31.81 DRIVER2.12 | DRIVER2.1 1.23,25.5 5.26,25.5 5.76,25 6,25 | IR2.3 25.75,2.33 PIC32.28 26.29,7.21 C9.2 27.5,8.5 | 12,20.7 12,19.29 C8.2 11.21,17.21 10.52,16.52 PIC32.13 | 7,34 7,27 6.5,27 6,26.5 6,25 | 6,25 8.5,25 | 23.85,14.3 23.85,12.15 27.5,8.5 | XBEE_ROBOT.1 28.73,8.5 27.5,8.5 | 8.5,24 14.5,24 | VOLTAGE_READ.1 R2.2
  Top 0.406: 8.5,25 8.5,24 | VOLT_REG.3 12,20.7 14.5,20.7 14.5,24 14.5,29.9 | 14.5,29.9 v14.5,37 | 14.5,29.9 25.5,29.9 25.5,29 25.7,28.8 26.76,28.8 | C5_VM2.1 2.5,34.5 3,34 5,34 7,34
  Bottom 0.305: v14.5,37 14.5,37.5 14.04,37.95 14.04,40.14 14.91,41 16.42,41 IR1.3 | IR1.3 18.63,42.5 19.92,43.8 26.25,43.8 27.54,42.5 VOLTAGE_READ.1 | IR1.3 17.92,39.72 SNAP.2
VABT_IN
  Top 0.406: SWITCH.2 10.75,25.59 VOLT_REG.1
VBAT_OUT
  Top 0.508: JST_PH_2PIN_CONN.1 10,36.24 9.45,35.69 9.45,30.19 SWITCH.1
VCAP
  Top 0.305: C10.2 16.26,3.37 15.47,4.16 15.47,4.54 15.6,4.67 PIC32.20
VCP1
  Top 0.305: C4_VCP1.1 24.75,27.2 24.98,26.98 DRIVER1.11
VCP2
  Top 0.305: C6_VCP2.1 5.25,31.25 4.47,30.48 DRIVER2.11
VINT1
  Top 0.305: C1_VINT1.2 21.85,26.22 22.7,26.22 23.02,25.89 DRIVER1.14
VINT2
  Top 0.305: C2_VINT2.2 2.52,30.3 DRIVER2.14
XBEE_PWM0
  Top 0.203: LED3.2 32.57,1.82 30.2,4.19 30.2,5.54 31.77,7.12 32.07,7.12 33.24,8.29 33.24,10.52 32.52,11.24 31.54,11.24 30.75,12.03 30.75,16.51 XBEE_ROBOT.6
XBEE_PWM1  (via drill 0.35)
  Top 0.203: XBEE_ROBOT.7 29.23,20 27.4,20 27.4,17.85 27.89,17.36 v27.89,12.11 | LED2.2 3.75,2.44 3.75,2.52 5,3.76 v5,7
  Bottom 0.203: v27.89,12.11 24.89,9.1 9,9.1 8.9,9 6.63,9 5.1,7.47 5.1,7.1 v5,7
XBEE_RESET  (via drill 0.35)
  Top 0.203: XBEE_PB.2 25.15,34 | 25.15,34 XBEE_PB.1 | 25.15,34 v26,34
  Bottom 0.203: v26,34 26.29,33.71 26.29,16.27 26.8,15.77 29.01,15.77 XBEE_ROBOT.5

### Text on the board
tPlace: GND | PWR | 1 | v6 | IR1 | P1 | P1 | PIC32 | XBEE | P1 | ON | OFF | P1 | P1 | M1 | OUT2 | P1 | OUT1 | M2 | OUT1 | OUT2 | P1 | B4 | B5 | A4 | B12 | B10 | B14 | P1 | SDA1 | P1 | SCL2 SDA2 | 2 | 3 | SCL1